# Altium schematic sheet MCU.SchDoc
size A4; SheetNumber: 1; SheetTotal: 1
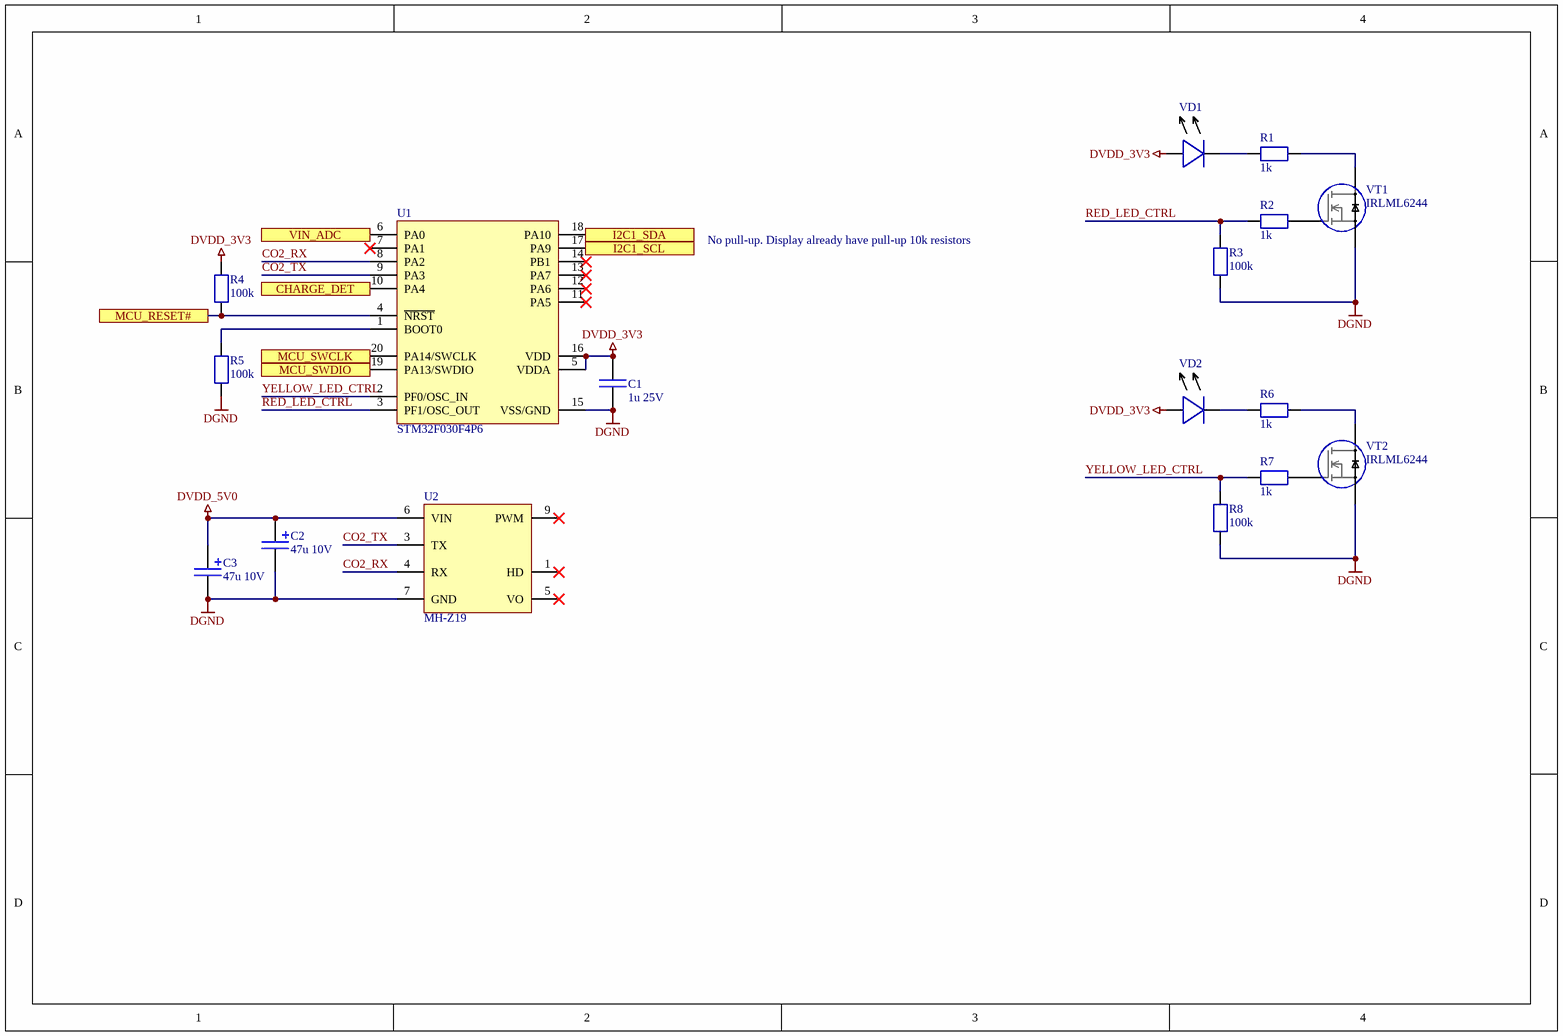
[diagram p0: MCU.SchDoc]

## Parts
C1  1u 25V  [C_0603/1608]
C2  47u 10V  [TECAP_TYPE_B]
C3  47u 10V  [TECAP_TYPE_B]
R1  1k  [R_0603/1608]
R2  1k  [R_0603/1608]
R3  100k  [R_0603/1608]
R4  100k  [R_0603/1608]
R5  100k  [R_0603/1608]
R6  1k  [R_0603/1608]
R7  1k  [R_0603/1608]
R8  100k  [R_0603/1608]
U1  STM32F030F4P6  [SO20_0.65]
U2  MH-Z19  [MH-Z19]
VD1  (no value)  [PLS-2 2.54]
VD2  (no value)  [PLS-2 2.54]
VT1  IRLML6244  [SOT23-3]
VT2  IRLML6244  [SOT23-3]

## Ports
CHARGE_DET, I2C1_SCL, I2C1_SDA, MCU_RESET#, MCU_SWCLK, MCU_SWDIO, VIN_ADC

## Nets
DGND: C1.2 C2.2(NEG) C3.2(NEG) R3.1 R5.1 R8.1 U1.15(VSS/GND) U2.7(GND) VT1.S VT2.S
DVDD_3V3: C1.1 R4.1 U1.5(VDDA) U1.16(VDD) VD1.A VD2.A
DVDD_5V0: C2.1(POS) C3.1(POS) U2.6(VIN)
CHARGE_DET: U1.10(PA4) ; port CHARGE_DET
CO2_RX: U1.8(PA2) U2.4(RX)
CO2_TX: U1.9(PA3) U2.3(TX)
I2C1_SCL: U1.17(PA9) ; port I2C1_SCL
I2C1_SDA: U1.18(PA10) ; port I2C1_SDA
MCU_RESET#: R4.2 U1.4(~{NRST}) ; port MCU_RESET#
MCU_SWCLK: U1.20(PA14/SWCLK) ; port MCU_SWCLK
MCU_SWDIO: U1.19(PA13/SWDIO) ; port MCU_SWDIO
RED_LED_CTRL: R2.2 R3.2 U1.3(PF1/OSC_OUT)
VIN_ADC: U1.6(PA0) ; port VIN_ADC
YELLOW_LED_CTRL: R7.2 R8.2 U1.2(PF0/OSC_IN)
NetR1_1: R1.1 VT1.D
NetR1_2: R1.2 VD1.C
NetR2_1: R2.1 VT1.G
NetR5_2: R5.2 U1.1(BOOT0)
NetR6_1: R6.1 VT2.D
NetR6_2: R6.2 VD2.C
NetR7_1: R7.1 VT2.G

Not connected (* = marked no-connect by the designer): U1 0(EP) 7(PA1)* 11(PA5)* 12(PA6)* 13(PA7)* 14(PB1)*; U2 0(EP) 1(HD)* 5(VO)* 9(PWM)*

## Notes on the sheet
- No pull-up. Display already have pull-up 10k resistors

## Library data of the parts
C1 = Capacitor: Non-polarized capacitor
C2 C3 = Capacitor polar: Polarized capacitor
R1-R8 = Resistor
U1 = STM32F030F: 32-bit Cortex-M0
U2 = MH-Z19: CO2 sensor
VD1 VD2 = LED: pin to pad: A>1 C>2
VT1 VT2 = MOSFET N: pin to pad: D>3 G>1 S>2